# EAGLE design BQ2980_EvalBoard (EAGLE 9.6.2)
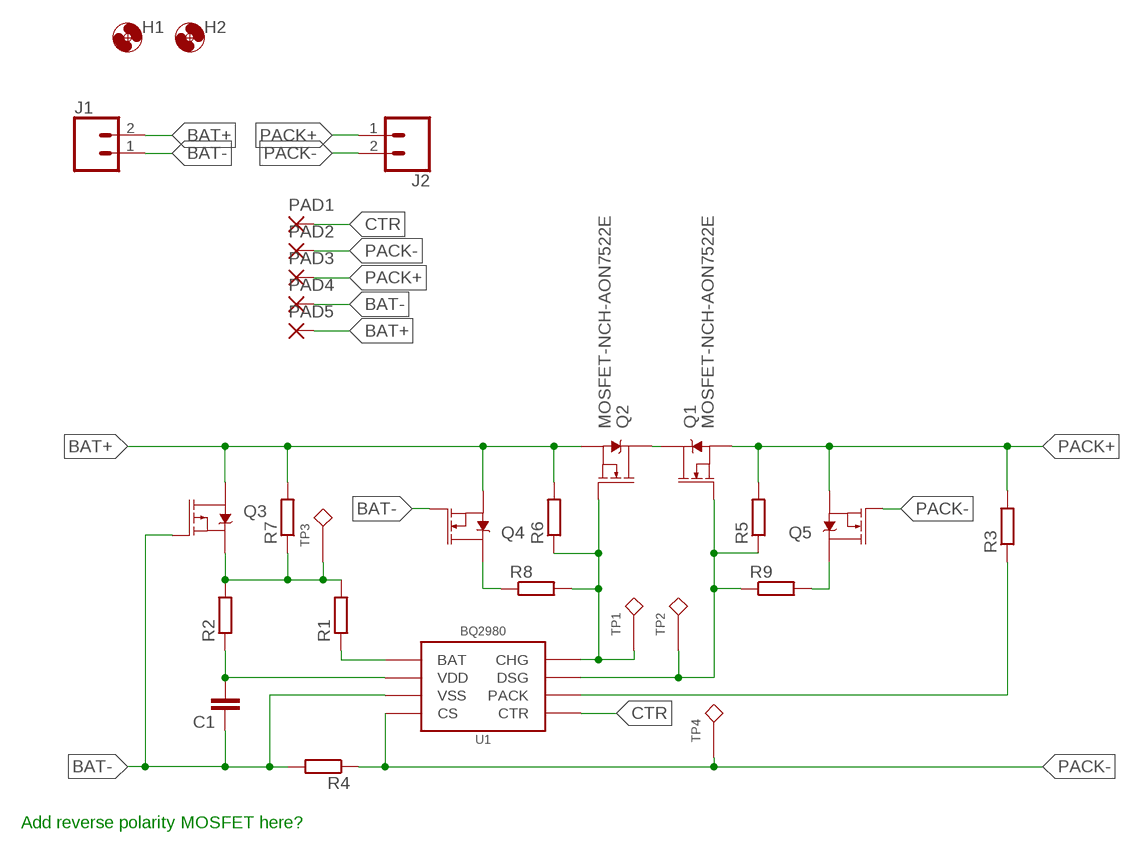
[diagram p0: schematic, sheet 1]

## Parts
C1  C-EUC0603  [C0603]
H1  MOUNTING_HOLE2_NP  [2_56]
H2  MOUNTING_HOLE2_NP  [2_56]
J1  CONN_023.5MM_ROUND_RESTRICT  [SCREWTERMINAL-3.5MM-2_ROUND_RESTRICT]
J2  CONN_023.5MM_ROUND_RESTRICT  [SCREWTERMINAL-3.5MM-2_ROUND_RESTRICT]
PAD1  SMD1,27  [SMD1,27-2,54]
PAD2  SMD1,27  [SMD1,27-2,54]
PAD3  SMD1,27  [SMD1,27-2,54]
PAD4  SMD1,27  [SMD1,27-2,54]
PAD5  SMD1,27  [SMD1,27-2,54]
Q1  MOSFET-NCH-AON7522E  [DFN3X3A_8L_EP1_P]
Q2  MOSFET-NCH-AON7522E  [DFN3X3A_8L_EP1_P]
Q3  MOSFET_PCH-NX2301P  [SOT23-3]
Q4  2N7002  MOSFET-NCH-2N7002PW  [SOT323]
Q5  2N7002  MOSFET-NCH-2N7002PW  [SOT323]
R1  R-EU_R0603  [R0603]
R2  R-EU_R0603  [R0603]
R3  R-EU_R0603  [R0603]
R4  R-EU_R0805  [R0805]
R5  R-EU_R0603  [R0603]
R6  R-EU_R0603  [R0603]
R7  R-EU_R0603  [R0603]
R8  R-EU_R0603  [R0603]
R9  R-EU_R0603  [R0603]
TP1  TESTPOINTRCU  [TESTPOINT_0603]
TP2  TESTPOINTRCU  [TESTPOINT_0603]
TP3  TESTPOINTRCU  [TESTPOINT_0603]
TP4  TESTPOINTRCU  [TESTPOINT_0603]
U1  BQ2980RUG  [RUG_S-PQFP-N8]

## Nets
BAT+: J1.2 PAD5.1(P) Q2.S@1(S) Q2.S@2(S) Q2.S@3(S) Q3.3(D) Q4.2(S) R6.2 R7.2
BAT-: C1.1 J1.1 PAD4.1(P) Q3.1(G) Q4.1(G) R4.2 U1.3(VSS)
CHG: Q2.G R6.1 R8.2 TP1.1 U1.8(CHG)
CTR: PAD1.1(P) U1.5(CTR)
DSG: Q1.G R5.1 R9.1 TP2.1 U1.7(DSG)
LOGIC_SUPPLY: Q3.2(S) R1.2 R2.2 R7.1 TP3.1
N$4: R3.1 U1.6(PACK)
N$5: C1.2 R2.1 U1.2(VDD)
N$6: R1.1 U1.1(BAT)
N$7: Q4.3(D) R8.1
N$8: Q5.3(D) R9.2
N$9: Q1.D Q2.D
PACK+: J2.1 PAD3.1(P) Q1.S@1(S) Q1.S@2(S) Q1.S@3(S) Q5.2(S) R3.2 R5.2
PACK-: J2.2 PAD2.1(P) Q5.1(G) R4.1 TP4.1 U1.4(CS)

## Notes on the sheet
- Add reverse polarity MOSFET here?

## Library data of the parts
C1 = bschulz_passives:C-EU: CAPACITOR, European symbol
H1 H2 = bschulz:MOUNTING_HOLE: Genaric Mechanical Mounting Hole Hole diameter based on max body diameter + 15% Keepout ring is for diameter of socket cap screw (minimum required clearance) TPlace ring is for diameter of pan head screw (recomended clearance) Specifications: Socket Cap <http://fastener-express.com/fastener-technical/SocketscapSS-Alloy.pdf> Button Head Socket Cap <http://fastener-express.com/fastener-technical/Button-Socket-alloy.pdf> Pan Head <http://fastener-express.com/fastener-technical/pan-machine-Screws.pdf>; DIGIKEY: DNP; MF: N/A; MPN: DNP
J1 J2 = bschulz:CONN_02: Genaric 2 terminal header SCREW_2.54 <https://www.digikey.com/product-detail/en/on-shore-technology-inc/OSTVN02A150/ED10561-ND/1588862> 39532_RA <https://www.digikey.com/product-detail/en/molex/0395321002/WM7845-ND/1280696>; DIGIKEY: ED2635-ND; MF: On Shore; MPN: OSTTE020161
PAD1-PAD5 = bschulz:SMD; DIGIKEY: N/A; MF: N/A; MPN: DNP
Q1 Q2 = bschulz:MOSFET-NCH: N-channel MOSFETs Voltage controlled devices that allow control of high current outputs. SparkFun Products: SparkFun OpenScale <https://www.sparkfun.com/products/13261> SparkFun Digital Sandbox <https://www.sparkfun.com/products/12651> SparkFun Monster Moto Shield <https://www.sparkfun.com/products/10182> SparkFun MOSFET Power Controller <https://www.sparkfun.com/products/11214>; DIGIKEY: 785-1505-1-ND; MF: Alpha & Omega; MPN: AON7522E
Q3 = bschulz:MOSFET_PCH: P-channel MOSFETs Voltage controlled devices that allow control of high current outputs. SparkFun Products: SparkFun ESP32 Thing <https://www.sparkfun.com/products/13907> SparkFun ESP8266 Thing <https://www.sparkfun.com/products/13231>; DIGIKEY: 1727-1148-1-ND; MF: Nexperia; MPN: NX2301P,215
Q4 Q5 = bschulz:MOSFET-NCH: N-channel MOSFETs Voltage controlled devices that allow control of high current outputs. SparkFun Products: SparkFun OpenScale <https://www.sparkfun.com/products/13261> SparkFun Digital Sandbox <https://www.sparkfun.com/products/12651> SparkFun Monster Moto Shield <https://www.sparkfun.com/products/10182> SparkFun MOSFET Power Controller <https://www.sparkfun.com/products/11214>; DIGIKEY: 2N7002W-FDICT-ND; MF: Diodes Incorporated; MPN: 2N7002W-7-F; PROD_ID: TRANS-11151
R1-R3 R5-R9 = bschulz_passives:R-EU_: RESISTOR, European symbol Digikey Parts: Yageo, 0402 <https://www.digikey.com/products/en/resistors/chip-resistor-surface-mount/52?k=&pkeyword=&sv=0&s=4356&sf=1&FV=-1%7C13%2C7%7C2%2C1291%7C39157%2C1989%7C0%2C-8%7C52%2C3%7C1131%2C3%7C2503&quantity=&ColumnSort=0&page=1&stock=1&pageSize=25> Yageo, 0603 <https://www.digikey.com/products/en/resistors/chip-resistor-surface-mount/52?k=&pkeyword=&sv=0&pv1291=39245&sf=1&FV=-5%7C4356%2C-5%7C47360%2C-8%7C52%2C-1%7C13%2C7%7C2%2C1989%7C0&quantity=10&ColumnSort=1000011&page=1&stock=1&pageSize=25> Panasonic, 0603 <https://www.digikey.com/products/en/resistors/chip-resistor-surface-mount/52?k=&pkeyword=&pv252=68&sf=0&FV=ffec373d%2C1c0002%2C142c040c%2C1f140000%2Cffe00034%2C80002%2Cc0001&quantity=&ColumnSort=0&page=1&stock=1&pageSize=25> Panasonic, precision, 0603 <https://www.digikey.com/products/en/resistors/chip-resistor-surface-mount/52?FV=ffec4907%2Cfffc000a%2Cc0172%2C142c040c%2C1f140000%2Cffe00034%2C1c0002&quantity=100&ColumnSort=2085&page=1&stock=1&pageSize=25> Panasonic, 0805 <https://www.digikey.com/products/en/resistors/chip-resistor-surface-mount/52?k=&pkeyword=&pv3=1&sf=0&FV=ffec373d%2C1c0002%2C1f140000%2Cffe00034%2C142c040d&quantity=&ColumnSort=0&page=1&stock=1&pageSize=25> Rohm, current sense <https://www.digikey.com/products/en/resistors/chip-resistor-surface-mount/52?k=&pkeyword=&pv3=1&sf=0&FV=ffecb688%2C1f140000%2Cffe00034%2C1c0002&quantity=&ColumnSort=0&page=1&stock=1&pageSize=25> Vishay, pulse proof automotive <https://www.digikey.com/products/en/resistors/chip-resistor-surface-mount/52?k=&pkeyword=&pv7=2&sf=0&FV=ffec5d6b%2Cffe00034%2C1f140000&quantity=&ColumnSort=0&page=1&stock=1&pageSize=25>; MF: Yageo
R4 = bschulz_passives:R-EU_: RESISTOR, European symbol Digikey Parts: Yageo, 0402 <https://www.digikey.com/products/en/resistors/chip-resistor-surface-mount/52?k=&pkeyword=&sv=0&s=4356&sf=1&FV=-1%7C13%2C7%7C2%2C1291%7C39157%2C1989%7C0%2C-8%7C52%2C3%7C1131%2C3%7C2503&quantity=&ColumnSort=0&page=1&stock=1&pageSize=25> Yageo, 0603 <https://www.digikey.com/products/en/resistors/chip-resistor-surface-mount/52?k=&pkeyword=&sv=0&pv1291=39245&sf=1&FV=-5%7C4356%2C-5%7C47360%2C-8%7C52%2C-1%7C13%2C7%7C2%2C1989%7C0&quantity=10&ColumnSort=1000011&page=1&stock=1&pageSize=25> Panasonic, 0603 <https://www.digikey.com/products/en/resistors/chip-resistor-surface-mount/52?k=&pkeyword=&pv252=68&sf=0&FV=ffec373d%2C1c0002%2C142c040c%2C1f140000%2Cffe00034%2C80002%2Cc0001&quantity=&ColumnSort=0&page=1&stock=1&pageSize=25> Panasonic, precision, 0603 <https://www.digikey.com/products/en/resistors/chip-resistor-surface-mount/52?FV=ffec4907%2Cfffc000a%2Cc0172%2C142c040c%2C1f140000%2Cffe00034%2C1c0002&quantity=100&ColumnSort=2085&page=1&stock=1&pageSize=25> Panasonic, 0805 <https://www.digikey.com/products/en/resistors/chip-resistor-surface-mount/52?k=&pkeyword=&pv3=1&sf=0&FV=ffec373d%2C1c0002%2C1f140000%2Cffe00034%2C142c040d&quantity=&ColumnSort=0&page=1&stock=1&pageSize=25> Rohm, current sense <https://www.digikey.com/products/en/resistors/chip-resistor-surface-mount/52?k=&pkeyword=&pv3=1&sf=0&FV=ffecb688%2C1f140000%2Cffe00034%2C1c0002&quantity=&ColumnSort=0&page=1&stock=1&pageSize=25> Vishay, pulse proof automotive <https://www.digikey.com/products/en/resistors/chip-resistor-surface-mount/52?k=&pkeyword=&pv7=2&sf=0&FV=ffec5d6b%2Cffe00034%2C1f140000&quantity=&ColumnSort=0&page=1&stock=1&pageSize=25>
TP1-TP4 = bschulz:TESTPOINT; DIGIKEY: A106145CT-ND; MF: TE Connectivity; MPN: RCU-0C
U1 = bschulz:BQ2980: BQ2980 - Voltage, Current, Temperature Protectors with an Integrated High-Side NFET (BMS) Characteristics: Vpack: < 20V Vdd: 1.5V ~ 5.5V Vbat: 1.5V ~ 5.5V IQ: 1μA Normal, 0.1μA Shutdown Operating Temperature: -40°C to 85°C Digikey: 296-47578-1-ND <https://www.digikey.com/product-detail/en/texas-instruments/BQ298000RUGT/296-47578-1-ND/8111032>; DIGIKEY: 296-47578-1-ND; MF: TI; MOUSER: 595-BQ298000RUGT; MPN: BQ298000RUGT

## Board
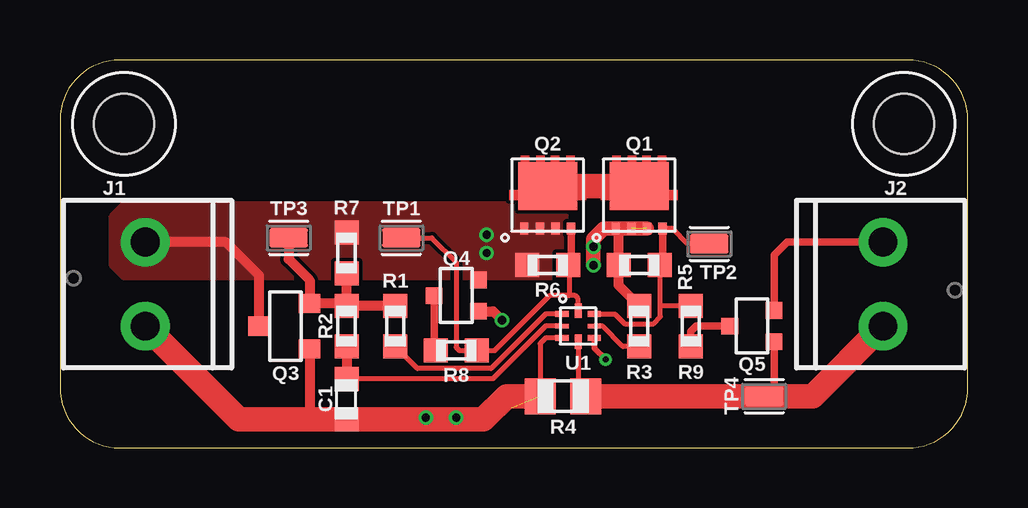
[diagram p1: board, top side]
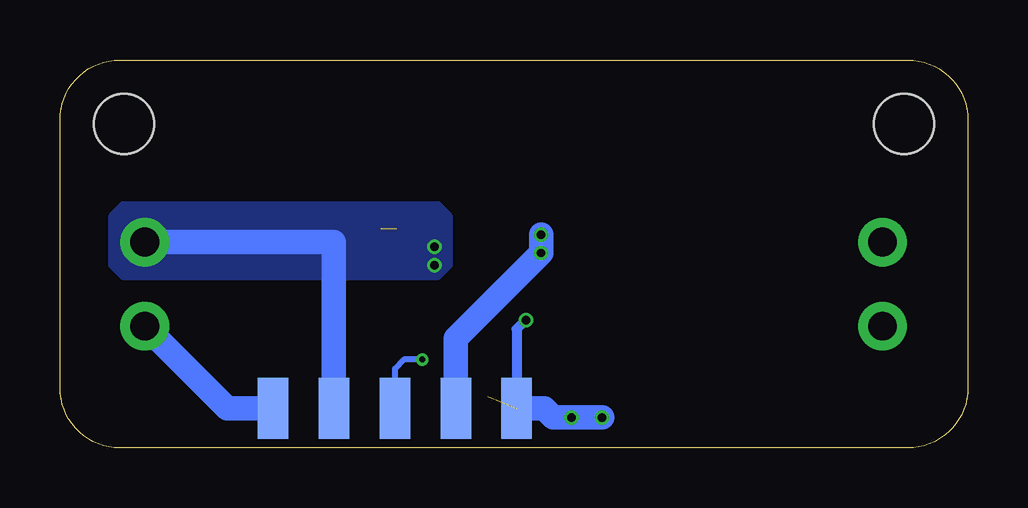
[diagram p2: board, bottom side, seen from below]

Size 37.83 x 16.18 mm. Coordinates in mm from the lower left corner, seen from the top.
Outline: 0,13.68 0,2.5 arc90 2.5,0 35.33,0 arc90 37.83,2.5 37.83,13.68 arc90 35.33,16.18 2.5,16.18 arc90 0,13.68
Copper layers (1*16): Top 0.035559375mm / dielectric 1.6mm / Bottom 0.035559375mm
Design rules "oshpark-2layer": minimum track width 6mil, minimum drill 10mil, track to track 6mil, track to pad 6mil, pad to pad 6mil, via to via 6mil, smd to smd 6mil, copper to edge 15mil, drill to drill 6mil, minimum pad ring 5mil, minimum via ring 5mil, stop-mask expansion 2.5mil, vias tented up to drill 0mil, thermal gap 10mil

### Footprints (pad centres in the part's own frame; a part is rotated, then mirrored left to right if it is on the bottom)
C0603 = smd 1 x 1: 1 -0.85,0; 2 0.85,0
2_56 = hole 2.5: 0,0
SCREWTERMINAL-3.5MM-2_ROUND_RESTRICT = drill 1.2 pad 2.032: 1 0,0; 2 3.5,0
SMD1,27-2,54 = smd 1.27 x 2.54: 1 0,0
DFN3X3A_8L_EP1_P = smd 2.45 x 1.98: D 0,0.381 | smd 0.35 x 0.5: G 0.975,-1.4; S@1 -0.975,-1.4; S@2 -0.325,-1.4; S@3 0.325,-1.4
SOT23-3 = smd 0.8 x 0.9: 1 -0.95,-1; 2 0.95,-1; 3 0,1.1
SOT323 = smd 0.7 x 0.7: 1 -0.65,-0.925; 2 0.65,-0.925; 3 0,0.925
R0603 = smd 1 x 1: 1 -0.85,0; 2 0.85,0
R0805 = smd 1.3 x 1.5: 1 -0.95,0; 2 0.95,0
TESTPOINT_0603 = smd 1.6 x 0.8: 1 0,0
RUG_S-PQFP-N8 = smd 0.55 x 0.25: 1 -0.675,0.5; 3 -0.675,-0.5; 5 0.675,-0.5; 7 0.675,0.5 | smd 0.55 x 0.2: 2 -0.675,0; 6 0.675,0 | smd 0.3 x 0.6: 4 0,-0.65; 8 0,0.65

### Placement (x,y rotation side)
C1  11.94,2.03 90 top
H1  35.16,13.51 0 top
H2  2.67,13.51 0 top
J1  3.56,5.08 90 top
J2  34.29,8.58 270 top
PAD1  23.88,1.65 0 bottom
PAD2  28.96,1.65 0 bottom
PAD3  26.42,1.65 0 bottom
PAD4  18.8,1.65 0 bottom
PAD5  21.34,1.65 0 bottom
Q1  24.13,10.54 0 top
Q2  20.32,10.54 0 top
Q3  9.4,5.08 90 top
Q4  16.51,6.35 90 top
Q5  28.83,5.08 90 top
R1  13.97,5.08 90 top
R2  11.94,5.08 90 top
R3  24.13,5.08 90 top
R4  20.95,2.16 180 top
R5  24.13,7.62 180 top
R6  20.32,7.62 180 top
R7  11.94,8.13 90 top
R8  16.51,4.06 0 top
R9  26.29,5.08 270 top
TP1  14.22,8.76 0 top
TP2  27.05,8.51 0 top
TP3  9.53,8.76 0 top
TP4  29.34,2.16 0 top
U1  21.59,5.08 0 top

### Tracks (layer width: path | path; a pad name or v marks a point on that pad's centre or on a via)
BAT+  (via drill 0.35)
  Top 0.406: Q3.3 8.3,7.2 6.91,8.58 J1.2
  Bottom 1.016: v17.78,8.89 v17.78,8.13 21.34,4.57 PAD5.1
  pour Top (no thermals): 20.58,7.11 2.66,7.11 2.16,7.61 2.16,9.66 2.66,10.16 20.58,10.16 21.08,9.66 21.08,7.61
BAT-  (via drill 0.35)  (1 unrouted)
  Top 0.2: U1.3 20.23,4.58 20,4.36 R4.2
  Top 0.406: Q3.1 10.4,1.29 10.29,1.18 | Q4.1 18.05,5.7 v18.41,5.33
  Top 1.016: J1.1 7.45,1.18 10.29,1.18 C1.1 17.63,1.18 18.61,2.16 R4.2
  Bottom 0.406: v18.41,5.33 18.8,4.95 PAD4.1
  Bottom 1.016: v15.24,1.27 v16.51,1.27 17.27,1.27 17.65,1.65 PAD4.1
CHG
  Top 0.2: U1.8 21.59,6.22 21.46,6.35 21.21,6.35 | 21.21,6.35 20.41,6.35 18.12,4.06 R8.2 16.64,4.06 16.51,4.19 16.51,7.75 15.49,8.76 TP1.1 | R6.1 21.21,7.58 21.21,6.35
  Top 0.305: Q2.G 21.3,7.75 R6.1
CTR  (via drill 0.25)
  Top 0.254: U1.5 22.27,4.15 v22.73,3.68
  Bottom 0.254: v22.73,3.68 23.5,3.68 23.88,3.3 PAD1.1
DSG
  Top 0.2: U1.7 23.12,5.58 23.52,5.18 24.73,5.18 25.02,5.46 25.02,5.97 | R5.1 25.02,7.58 25.02,5.97 | R9.1 25.06,5.93 25.02,5.97 | TP2.1 26.16,8.51 25.53,9.14 Q1.G
  Top 0.305: Q1.G 25.11,7.75 R5.1
LOGIC_SUPPLY
  Top 0.406: TP3.1 9.53,7.87 10.4,7 Q3.2 11.84,6.03 R2.2 | R2.2 R7.1 | R1.2 R2.2
N$4
  Top 0.2: R3.1 23.46,4.23 22.61,5.08 U1.6
N$5
  Top 0.2: U1.2 20.23,5.08 18.03,2.88 C1.2
  Top 0.406: R2.1 C1.2
N$6
  Top 0.2: U1.1 20.23,5.58 17.96,3.31 14.89,3.31 R1.1
N$7
  Top 0.305: Q4.3 15.59,4.14 R8.1
N$8
  Top 0.305: R9.2 26.29,4.87 26.5,5.08 Q5.3
N$9
  Top 1.016: Q2.D Q1.D
PACK+  (via drill 0.35)  (1 unrouted)
  Top 0.305: Q5.2 29.75,8.04 30.3,8.58 J2.1
  Top 0.406: Q1.S@1 23.28,9.02 R5.2 23.28,6.78 R3.2
  Top 0.61: Q1.S@3 Q1.S@1 22.65,9.14 22.23,8.72 v22.23,8.38 v22.23,7.62
  Bottom 1.016: PAD3.1 26.42,8.58 J2.1
  pour Bottom (no thermals): 35.69,7.61 35.69,9.66 35.19,10.16 22.09,10.16 21.59,9.66 21.59,7.61 22.09,7.11 35.19,7.11
PACK-
  Top 0.2: U1.4 21.59,2.47 R4.1
  Top 0.305: Q5.1 29.75,2.58 TP4.1
  Top 1.016: R4.1 TP4.1 31.37,2.16 J2.2
  Bottom 1.016: PAD2.1 30.86,1.65 J2.2

### Text on the board
tDocu: BQ2980 Eval Board / v0.0 / Bobby Schulz | + | + | DSG | LOGIC | CHG | PACK | - | - | BAT | PACK-
bDocu: Break44 | BAT- | BAT+ | CTR | PACK+ | PACK-